# Altium project CATS-GS.PrjPcb
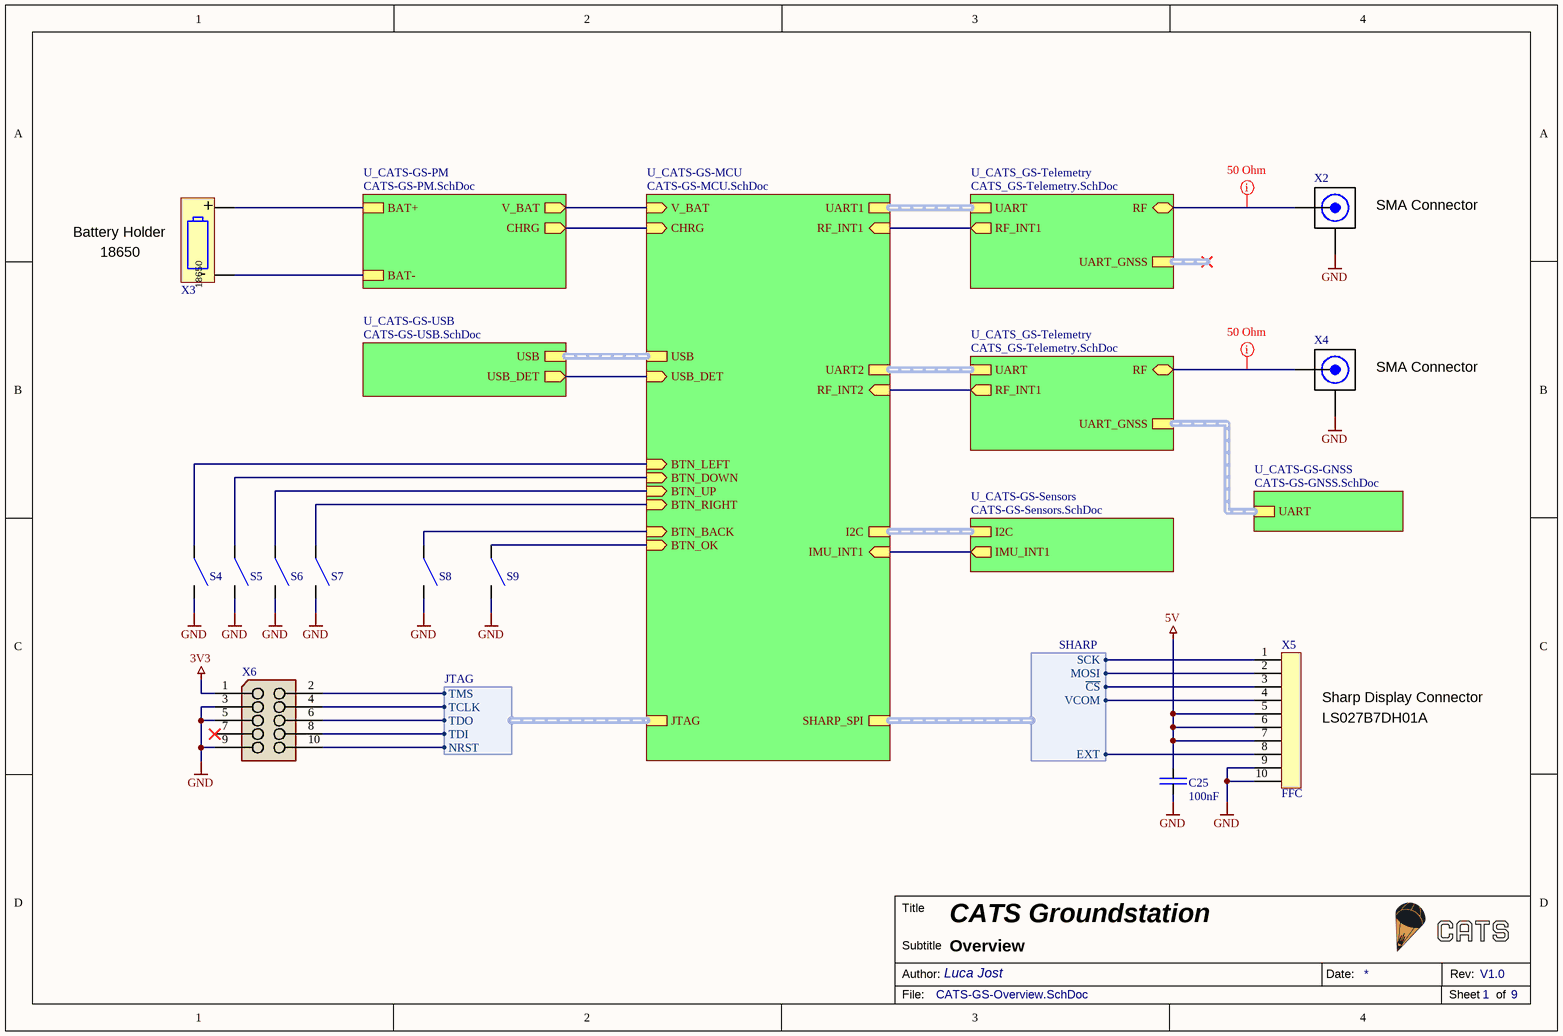
[diagram p0: CATS-GS-Overview.SchDoc]
9 sheets, 140 parts. Net scope: hierarchical (ports join the sheet entries above them; power ports are global).
Board file: CATS-GS.PcbDoc
Sheets:
  CATS-GS-Overview.SchDoc
    U_CATS-GS-Sensors = CATS-GS-Sensors.SchDoc
    U_CATS_GS-Telemetry = CATS_GS-Telemetry.SchDoc
      U_Reefing-Radio = CATS_GS-Radio.SchDoc
      U_Reefing-Radio_MCU = CATS_GS-Radio_MCU.SchDoc
    U_CATS_GS-Telemetry = CATS_GS-Telemetry.SchDoc
      U_Reefing-Radio = CATS_GS-Radio.SchDoc
      U_Reefing-Radio_MCU = CATS_GS-Radio_MCU.SchDoc
    U_CATS-GS-GNSS = CATS-GS-GNSS.SchDoc
    U_CATS-GS-PM = CATS-GS-PM.SchDoc
    U_CATS-GS-USB = CATS-GS-USB.SchDoc
    U_CATS-GS-MCU = CATS-GS-MCU.SchDoc

## Sheet CATS-GS-Overview.SchDoc: CATS Groundstation
size A4; DocumentNumber: Overview; Revision: V1.0; SheetNumber: 1; SheetTotal: 9; Author: Luca Jost; Subtitle: Overview

### Parts
C25  100nF  [SMD Keramikkondensator 0402]
S4  SMD-Button  [SMD Button 4.2x3.2]  (value not drawn)
S5  SMD-Button  [SMD Button 4.2x3.2]  (value not drawn)
S6  SMD-Button  [SMD Button 4.2x3.2]  (value not drawn)
S7  SMD-Button  [SMD Button 4.2x3.2]  (value not drawn)
S8  SMD-Button  [SMD Button 4.2x3.2]  (value not drawn)
S9  SMD-Button  [SMD Button 4.2x3.2]  (value not drawn)
X2  SMA Connector  [SMD Connector SMA]  (value not drawn)
X3  18650  [SMD 18650 Batttery Holder]  (value not drawn)
X4  SMA Connector  [SMD Connector SMA]  (value not drawn)
X5  FFC  [SMD Connector FFC/FPC 10Pin / 0.5mm Pitch]
X6  JTAG-Header (ARM-Cortex)  [SMD Connector 1.27mm (2x5)]  (value not drawn)

### Sub-sheets
U_CATS-GS-GNSS = CATS-GS-GNSS.SchDoc: UART (harness UART)
U_CATS-GS-MCU = CATS-GS-MCU.SchDoc: SHARP_SPI (harness SHARP), USB (harness USB), JTAG (harness JTAG), UART2 (harness UART), UART1 (harness UART), RF_INT1 (in), RF_INT2 (in), I2C, IMU_INT1 (in), USB_DET (in), CHRG (in), V_BAT (in), BTN_OK (in), BTN_BACK (in), BTN_RIGHT (in), BTN_UP (in), BTN_DOWN (in), BTN_LEFT (in)
U_CATS-GS-PM = CATS-GS-PM.SchDoc: BAT+, BAT-, V_BAT (out), CHRG (out)
U_CATS-GS-Sensors = CATS-GS-Sensors.SchDoc: I2C (harness I2C), IMU_INT1 (out)
U_CATS-GS-USB = CATS-GS-USB.SchDoc: USB (harness USB), USB_DET (out)
U_CATS_GS-Telemetry = CATS_GS-Telemetry.SchDoc: UART, RF_INT1 (out), UART_GNSS, RF (bidir)
U_CATS_GS-Telemetry = CATS_GS-Telemetry.SchDoc: UART, RF_INT1 (out), UART_GNSS, RF (bidir)

### Harnesses
JTAG: TMS, TDI, TDO, TCLK, NRST
SHARP: MOSI, ~{CS}, SCK, VCOM, EXT

### Nets
3V3: X6.1
5V: C25.2 X5.5 X5.6 X5.7
BGND: X3.2(-) ; sheet U_CATS-GS-PM/BAT-
GND: C25.1 S4.2 S5.2 S6.2 S7.2 S8.2 S9.2 X2.2(RF) X4.2(RF) X5.9 X5.10 X6.3 X6.5 X6.9
VBAT: X3.1(+) ; sheet U_CATS-GS-PM/BAT+
~{CS}: X5.3 ; sheet U_CATS-GS-MCU/SHARP_SPI.~{CS}
DIS_EXT: X5.8 ; sheet U_CATS-GS-MCU/SHARP_SPI.EXT
DIS_VCOM: X5.4 ; sheet U_CATS-GS-MCU/SHARP_SPI.VCOM
JTAG_NRST: X6.10 ; sheet U_CATS-GS-MCU/JTAG.NRST
JTAG_TCLK: X6.4 ; sheet U_CATS-GS-MCU/JTAG.TCLK
JTAG_TDI: X6.8 ; sheet U_CATS-GS-MCU/JTAG.TDI
JTAG_TDO: X6.6 ; sheet U_CATS-GS-MCU/JTAG.TDO
JTAG_TMS: X6.2 ; sheet U_CATS-GS-MCU/JTAG.TMS
MOSI: X5.2 ; sheet U_CATS-GS-MCU/SHARP_SPI.MOSI
RF_INT1: sheet U_CATS_GS-Telemetry/RF_INT1, sheet U_CATS-GS-MCU/RF_INT1
RF_INT1: sheet U_CATS_GS-Telemetry/RF_INT1, sheet U_CATS-GS-MCU/RF_INT2  [a separate net that carries the same name]
SCK: X5.1 ; sheet U_CATS-GS-MCU/SHARP_SPI.SCK
NetC5_2: sheet U_CATS-GS-PM/V_BAT, sheet U_CATS-GS-MCU/V_BAT
NetFL1_U_CATS_GS-Telemetry_U_Reefing-Radio#1_3: X2.1(RF) ; sheet U_CATS_GS-Telemetry/RF
NetFL1_U_CATS_GS-Telemetry_U_Reefing-Radio#2_3: X4.1(RF) ; sheet U_CATS_GS-Telemetry/RF
NetP1_K: sheet U_CATS-GS-PM/CHRG, sheet U_CATS-GS-MCU/CHRG
NetR1_2: sheet U_CATS-GS-USB/USB_DET, sheet U_CATS-GS-MCU/USB_DET
NetS4_1: S4.1 ; sheet U_CATS-GS-MCU/BTN_LEFT
NetS5_1: S5.1 ; sheet U_CATS-GS-MCU/BTN_DOWN
NetS6_1: S6.1 ; sheet U_CATS-GS-MCU/BTN_UP
NetS7_1: S7.1 ; sheet U_CATS-GS-MCU/BTN_RIGHT
NetS8_1: S8.1 ; sheet U_CATS-GS-MCU/BTN_BACK
NetS9_1: S9.1 ; sheet U_CATS-GS-MCU/BTN_OK
NetTP17_1: sheet U_CATS-GS-Sensors/IMU_INT1, sheet U_CATS-GS-MCU/IMU_INT1

Not connected (* = marked no-connect by the designer): X6 7*

### Buses and harness runs
harness sheet U_CATS-GS-GNSS/UART = sheet U_CATS_GS-Telemetry/UART_GNSS
harness sheet U_CATS-GS-MCU/I2C = sheet U_CATS-GS-Sensors/I2C
harness sheet U_CATS-GS-MCU/UART1 = sheet U_CATS_GS-Telemetry/UART
harness sheet U_CATS-GS-MCU/UART2 = sheet U_CATS_GS-Telemetry/UART
harness sheet U_CATS-GS-MCU/USB = sheet U_CATS-GS-USB/USB

### Layout directives
rule Impedance Constraint [Min = 50.00    Max = 50.00    ]; net class RF-Line 50: NetFL1_U_CATS_GS-Telemetry_U_Reefing-Radio#1_3, NetFL1_U_CATS_GS-Telemetry_U_Reefing-Radio#2_3

### Notes on the sheet
- (near X3) Battery Holder
- (near X2) SMA Connector
- 18650
- (near X4) SMA Connector
- (near X5) Sharp Display Connector
- (near X5) LS027B7DH01A
- Title
- Author:
- Subtitle
- Date:
- Rev:
- File:
- Sheet
- of

### Library data of the parts
C25 = E6 - 100nF: SMD Ceramic Capacitor E6; Unit Price: 0.01; JLC: C307331
S4-S9 = Button 4.2mmx3.2mm: Button SPST; LCSC: C139797
X2 X4 = SMA Connector: Female SMA Connector THT; JLC: C496550
X3 = 18650 Battery Holder: Single 18650 Battery Holder; JLC: C2988620; ComponentLink1Description: Datasheet; ComponentLink1URL: https://datasheet.lcsc.com/lcsc/2204021730_MYOUNG-BH-18650-B1BA002_C2988620.pdf
X5 = FPC/FFC 10 Pin / P 0.5: 10 Pin FPC/FFC Connector 0.5mm Pitch, Bottom Contact; JLC: C481219; ComponentLink1Description: Datasheet; ComponentLink1URL: https://datasheet.lcsc.com/lcsc/2001071405_XFCN-F0502-B-10-20T-R_C481219.pdf
X6 = X-JTAG-Header (ARM-Cortex): Component Value: SHF-105-01-L-D-SM (2x5); Digikey: SAM10710-ND; Farnell: 1885915; Mouser: 200-SHF10501LDSM; Unit Price: 2.89; ComponentLink1Description: Datasheet; ComponentLink1URL: https://datasheet.lcsc.com/lcsc/1810170717_UNI-ROYAL-Uniroyal-Elec-4D03WGJ0331T5E_C12018.pdf; Component Description: JTAG-Header (ARM-Cortex)

## Sheet CATS-GS-Sensors.SchDoc: CATS Groundstation
size A4; DocumentNumber: Overview; Revision: V1.0; SheetNumber: 4; SheetTotal: 9; Author: Luca Jost; Subtitle: Sensors
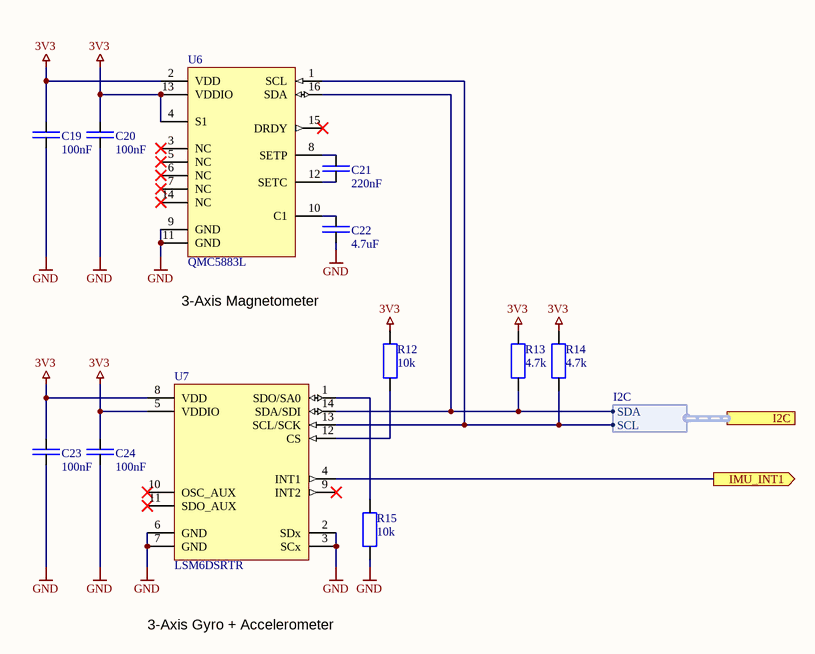
[diagram p1: CATS-GS-Sensors.SchDoc]

### Parts
C19  100nF  [SMD Keramikkondensator 0402]
C20  100nF  [SMD Keramikkondensator 0402]
C21  220nF  [SMD Keramikkondensator 0402]
C22  4.7uF  [SMD Keramikkondensator 0402]
C23  100nF  [SMD Keramikkondensator 0402]
C24  100nF  [SMD Keramikkondensator 0402]
R12  10k  [SMD Widerstand 0402]
R13  4.7k  [SMD Widerstand 0402]
R14  4.7k  [SMD Widerstand 0402]
R15  10k  [SMD Widerstand 0402]
U6  QMC5883L  [SMD IC LGA-16 4/4]
U7  LSM6DSRTR  [SMD IC LGA-14]

### Ports
I2C (harness I2C), IMU_INT1 (out)

### Harnesses
I2C: SCL, SDA

### Nets
3V3: C19.2 C20.2 C23.2 C24.2 R12.2 R13.2 R14.2 U6.2(VDD) U6.4(S1) U6.13(VDDIO) U7.5(VDDIO) U7.8(VDD)
GND: C19.1 C20.1 C22.1 C23.1 C24.1 R15.1 U6.9(GND) U6.11(GND) U7.2(SDx) U7.3(SCx) U7.6(GND) U7.7(GND)
SCL: R14.1 U6.1(SCL) U7.13(SCL/SCK) ; port I2C.SCL
SDA: R13.1 U6.16(SDA) U7.14(SDA/SDI) ; port I2C.SDA
NetC21_1: C21.1 U6.12(SETC)
NetC21_2: C21.2 U6.8(SETP)
NetC22_2: C22.2 U6.10(C1)
NetR12_1: R12.1 U7.12(CS)
NetR15_2: R15.2 U7.1(SDO/SA0)
NetTP17_1: U7.4(INT1) ; port IMU_INT1

Not connected (* = marked no-connect by the designer): U6 3(NC)* 5(NC)* 6(NC)* 7(NC)* 14(NC)* 15(DRDY)*; U7 9(INT2)* 10(OSC_AUX)* 11(SDO_AUX)*

### Notes on the sheet
- 3-Axis Magnetometer
- 3-Axis Gyro + Accelerometer
- Title
- Author:
- Subtitle
- Date:
- Rev:
- File:
- Sheet
- of

### Library data of the parts
C19 C20 C23 C24 = E6 - 100nF: SMD Ceramic Capacitor E6; Unit Price: 0.01; JLC: C307331
C21 = E6 - 220nF: SMD Ceramic Capacitor E6; Unit Price: 0.01; Number: -; Supplier: -; JLC: C16772
C22 = E6 - 4.7uF: SMD Ceramic Capacitor E6; Unit Price: 0.01; JLC: C23733
R12 R15 = E24 - 10k: SMD Chip Resistor E24; Unit Price: 0.01; Number: -; Supplier: -; JLC: C25744
R13 R14 = E24 - 4.7k: SMD Chip Resistor E24; Unit Price: 0.01; Number: -; Supplier: -; JLC: C25900
U6 = QMC5883L: 3-Axis Magnetic Sensor; JLC: C976032; ComponentLink1Description: Datasheet; ComponentLink1URL: https://datasheet.lcsc.com/lcsc/2012221837_QST-QMC5883L_C976032.pdf
U7 = LSM6DSRTR: Accelerometer, Gyroscope, Temperature, 6 Axis Sensor I²C, SPI Output; ComponentLink1Description: Datasheet; ComponentLink1URL: https://datasheet.lcsc.com/lcsc/2201131130_STMicroelectronics-LSM6DSRTR_C784817.pdf; JLC: C784817; Unit Price: 4.88

## Sheet CATS_GS-Telemetry.SchDoc: CATS Groundstation
size A4; DocumentNumber: Subtitle; Revision: V1.0; SheetNumber: 6; SheetTotal: 9; Author: Luca Jost; Subtitle: Telemetry
Used 2 times, as channels U_CATS_GS-Telemetry, U_CATS_GS-Telemetry. Parts and nets are listed once, with the designators drawn on the sheet.
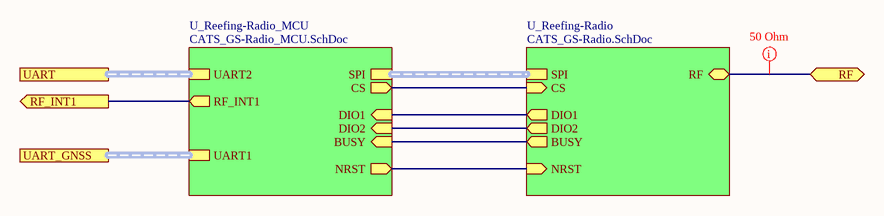
[diagram p2: CATS_GS-Telemetry.SchDoc]

### Sub-sheets
U_Reefing-Radio = CATS_GS-Radio.SchDoc: SPI (harness SPI), CS (in), BUSY (out), DIO1 (out), DIO2 (out), RF (bidir), NRST (in)
U_Reefing-Radio_MCU = CATS_GS-Radio_MCU.SchDoc: SPI (harness SPI), RF_INT1 (out), UART2 (harness UART), BUSY (in), DIO2 (in), DIO1 (in), CS (out), UART1 (harness UART), NRST (out)

### Ports
RF (bidir), RF_INT1 (out), UART, UART_GNSS

### Nets
RF: port RF, sheet U_Reefing-Radio/RF
RF_INT1: port RF_INT1, sheet U_Reefing-Radio_MCU/RF_INT1
(unnamed): sheet U_Reefing-Radio/CS, sheet U_Reefing-Radio_MCU/CS
(unnamed): sheet U_Reefing-Radio/BUSY, sheet U_Reefing-Radio_MCU/BUSY
(unnamed): sheet U_Reefing-Radio/DIO1, sheet U_Reefing-Radio_MCU/DIO1
(unnamed): sheet U_Reefing-Radio/DIO2, sheet U_Reefing-Radio_MCU/DIO2
(unnamed): sheet U_Reefing-Radio/NRST, sheet U_Reefing-Radio_MCU/NRST

### Channels
U_CATS_GS-Telemetry: ports RF=NetFL1_U_CATS_GS-Telemetry_U_Reefing-Radio#1_3 RF_INT1=RF_INT1
U_CATS_GS-Telemetry: ports RF=NetFL1_U_CATS_GS-Telemetry_U_Reefing-Radio#2_3 RF_INT1=RF_INT1

### Buses and harness runs
harness port UART = sheet U_Reefing-Radio_MCU/UART2
harness port UART_GNSS = sheet U_Reefing-Radio_MCU/UART1
harness sheet U_Reefing-Radio/SPI = sheet U_Reefing-Radio_MCU/SPI

### Layout directives
rule Impedance Constraint [Min = 50.00    Max = 50.00    ]; net class RF-Line 50: NetFL1_U_CATS_GS-Telemetry_U_Reefing-Radio#1_3

### Notes on the sheet
- Title
- Author:
- Subtitle
- Date:
- Rev:
- File:
- Sheet
- of

## Sheet CATS_GS-Radio.SchDoc: CATS Groundstation
size A4; DocumentNumber: Subtitle; Revision: V1.0; SheetNumber: 8; SheetTotal: 9; Author: Luca Jost; Subtitle: Radio
Used 2 times, as channels U_CATS_GS-Telemetry/U_Reefing-Radio, U_CATS_GS-Telemetry/U_Reefing-Radio. Parts and nets are listed once, with the designators drawn on the sheet.
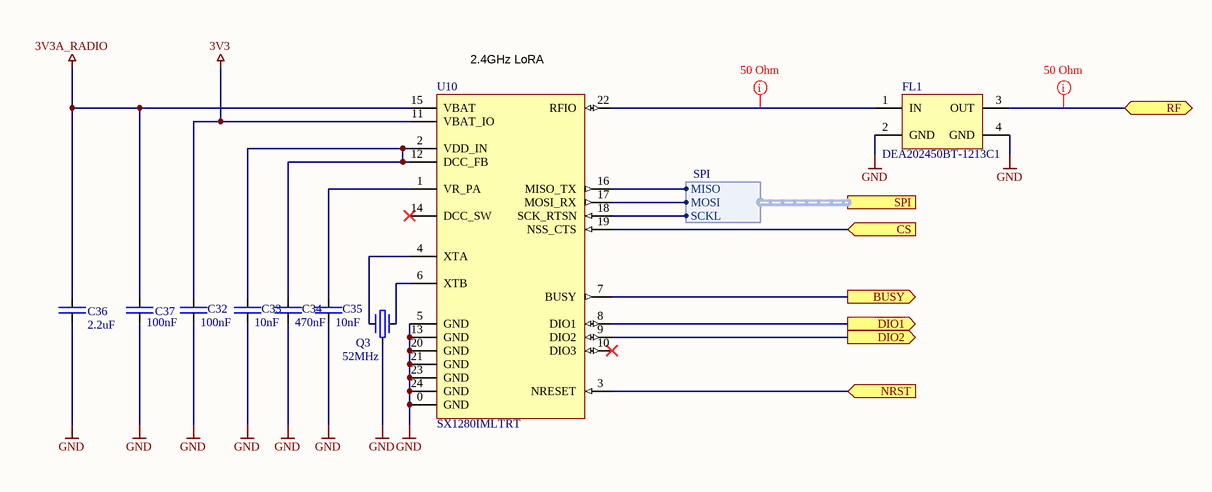
[diagram p3: CATS_GS-Radio.SchDoc]

### Parts
C32  100nF  [SMD Keramikkondensator 0402]
C33  10nF  [SMD Keramikkondensator 0402]
C34  470nF  [SMD Keramikkondensator 0402]
C35  10nF  [SMD Keramikkondensator 0402]
C36  2.2uF  [SMD Keramikkondensator 0402]
C37  100nF  [SMD Keramikkondensator 0402]
FL1  DEA202450BT-1213C1  [SMD Filter DEA202450BT]
Q3  52MHz  [SMD Crystal 2520]
U10  SX1280IMLTRT  [SMD IC QFN-24]

### Ports
BUSY (out), CS (in), DIO1 (out), DIO2 (out), NRST (in), RF (bidir), SPI (harness SPI)

### Harnesses
SPI: SCKL, MOSI, MISO

### Nets
3V3: C32.2 U10.11(VBAT_IO)
3V3A_RADIO: C36.2 C37.2 U10.15(VBAT)
GND: C32.1 C33.1 C34.1 C35.1 C36.1 C37.1 FL1.2(GND) FL1.4(GND) Q3.3 U10.0(GND) U10.5(GND) U10.13(GND) U10.20(GND) U10.21(GND) U10.23(GND) U10.24(GND)
BUSY: U10.7(BUSY) ; port BUSY
CS: U10.19(NSS_CTS) ; port CS
DIO1: U10.8(DIO1) ; port DIO1
DIO2: U10.9(DIO2) ; port DIO2
NRST: U10.3(NRESET) ; port NRST
RF: FL1.3(OUT) ; port RF
NetC33_2: C33.2 C34.2 U10.2(VDD_IN) U10.12(DCC_FB)
NetC35_2: C35.2 U10.1(VR_PA)
NetFL1_1: FL1.1(IN) U10.22(RFIO)
NetQ3_1: Q3.1 U10.4(XTA)
NetQ3_2: Q3.2 U10.6(XTB)
NetU10_16: U10.16(MISO_TX) ; port SPI.MISO
NetU10_17: U10.17(MOSI_RX) ; port SPI.MOSI
NetU10_18: U10.18(SCK_RTSN) ; port SPI.SCKL

Not connected (* = marked no-connect by the designer): U10 10(DIO3)* 14(DCC_SW)*

### Channels
U_CATS_GS-Telemetry/U_Reefing-Radio: designators end in _U_CATS_GS-Telemetry_U_Reefing-Radio#1; ports BUSY=BUSY CS=CS DIO1=DIO1 DIO2=DIO2 NRST=NetU9_U_CATS_GS-Telemetry_U_Reefing-Radio_MCU#1_19 RF=NetFL1_U_CATS_GS-Telemetry_U_Reefing-Radio#1_3
U_CATS_GS-Telemetry/U_Reefing-Radio: designators end in _U_CATS_GS-Telemetry_U_Reefing-Radio#2; ports BUSY=BUSY CS=CS DIO1=DIO1 DIO2=DIO2 NRST=NetU9_U_CATS_GS-Telemetry_U_Reefing-Radio_MCU#2_19 RF=NetFL1_U_CATS_GS-Telemetry_U_Reefing-Radio#2_3

### Layout directives
rule Impedance Constraint [Min = 50.00    Max = 50.00    ]; net class RF-Line 50: NetFL1_U_CATS_GS-Telemetry_U_Reefing-Radio#1_1, NetFL1_U_CATS_GS-Telemetry_U_Reefing-Radio#1_3

### Notes on the sheet
- (near U10) 2.4GHz LoRA
- Title
- Author:
- Subtitle
- Date:
- Rev:
- File:
- Sheet
- of

### Library data of the parts
C32 C37 = E6 - 100nF: SMD Ceramic Capacitor E6; Unit Price: 0.01; JLC: C307331
C33 C35 = E6 - 10nF: SMD Ceramic Capacitor E6; Unit Price: 0.01; JLC: C15195
C34 = E6 - 470nF: SMD Ceramic Capacitor E6; Unit Price: 0.01; JLC: C47339
C36 = E6 - 2.2uF: SMD Ceramic Capacitor E6; Unit Price: 0.01; JLC: C193620
FL1 = DEA202450BT-1213C1: Multilayer Band Pass Filter 2400-2500MHz; ComponentLink1Description: Datasheet; ComponentLink1URL: https://datasheet.lcsc.com/lcsc/1811021613_TDK-DEA202450BT-1213C1_C307898.pdf; JLC: C307898
Q3 = Crystal 52MHz - 2520: 52Mhz Ceramic 2.5 x 2.0mm SMD 10pF 60Ω ±10ppm; JLC: C963550; ComponentLink1Description: Datasheet; ComponentLink1URL: https://datasheet.lcsc.com/lcsc/2012211835_WTL-WTL2M75523TW_C963550.pdf; Unit Price: 0.39
U10 = SX1280IMLTRT: Long Range, Low Power, 2.4 GHz / Transceiver with Ranging Capability; ComponentLink1Description: Datasheet; ComponentLink1URL: https://media.digikey.com/pdf/Data%20Sheets/Semtech%20PDFs/SX1280-81_Rev3.2_Mar2020.pdf; Digikey: SX1280IMLTRTCT-ND; JLC: C125969; Unit Price: 3.20

## Sheet CATS_GS-Radio_MCU.SchDoc: CATS Groundstation
size A4; DocumentNumber: Subtitle; Revision: V1.0; SheetNumber: 7; SheetTotal: 9; Author: Luca Jost; Subtitle: Radio MCU
Used 2 times, as channels U_CATS_GS-Telemetry/U_Reefing-Radio_MCU, U_CATS_GS-Telemetry/U_Reefing-Radio_MCU. Parts and nets are listed once, with the designators drawn on the sheet.
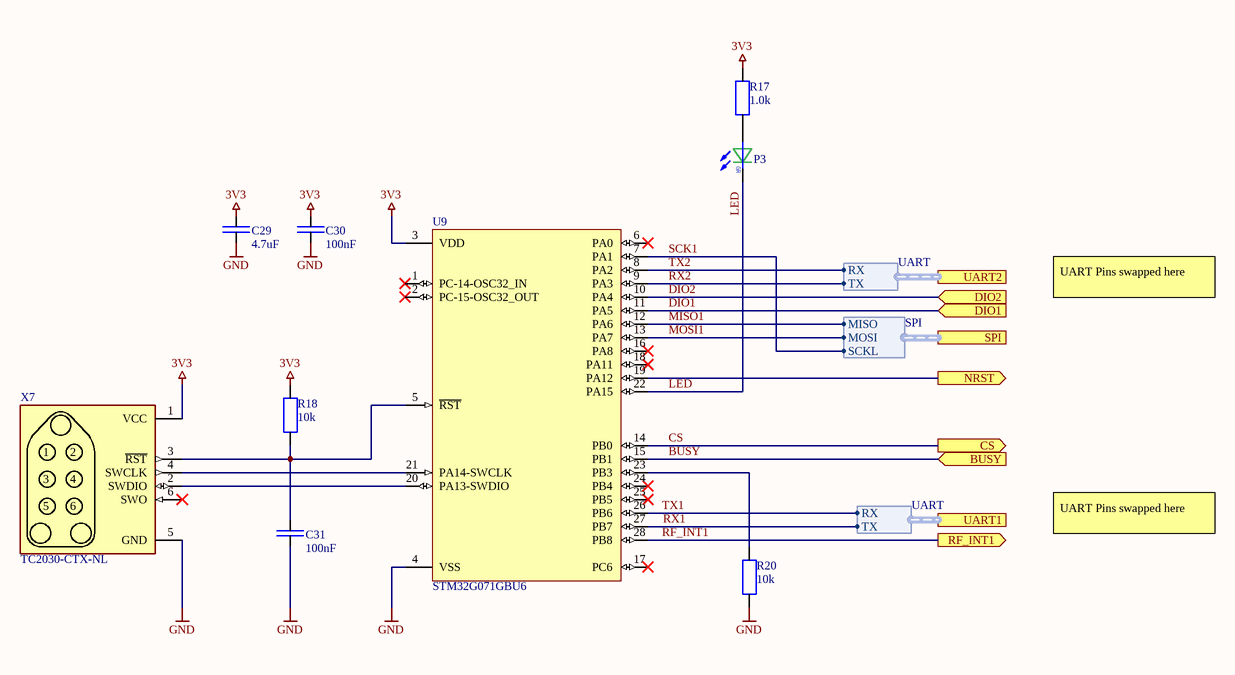
[diagram p4: CATS_GS-Radio_MCU.SchDoc]

### Parts
C29  4.7uF  [SMD Keramikkondensator 0402]
C30  100nF  [SMD Keramikkondensator 0402]
C31  100nF  [SMD Keramikkondensator 0402]
P3  LED  [SMD LED 0603]  (value not drawn)
R17  1.0k  [SMD Widerstand 0402]
R18  10k  [SMD Widerstand 0402]
R20  10k  [SMD Widerstand 0402]
U9  STM32G071GBU6  [SMD IC QFN-28 4x4 0.5 Pitch]
X7  TC2030-CTX-NL  [SMD Connector TC2030]  (no BOM)

### Ports
BUSY (in), CS (out), DIO1 (in), DIO2 (in), NRST (out), RF_INT1 (out), SPI (harness SPI), UART1 (harness UART), UART2 (harness UART)

### Harnesses
SPI: SCKL, MOSI, MISO
UART: RX, TX

### Nets
3V3: C29.2 C30.2 R17.2 R18.2 U9.3(VDD) X7.1(VCC)
GND: C29.1 C30.1 C31.1 R20.1 U9.4(VSS) X7.5(GND)
BUSY: U9.15(PB1) ; port BUSY
CS: U9.14(PB0) ; port CS
DIO1: U9.11(PA5) ; port DIO1
DIO2: U9.10(PA4) ; port DIO2
LED: P3.K U9.22(PA15)
MISO1: U9.12(PA6) ; port SPI.MISO
MOSI1: U9.13(PA7) ; port SPI.MOSI
NRST: U9.19(PA12) ; port NRST
RF_INT1: U9.28(PB8) ; port RF_INT1
RX1: U9.27(PB7) ; port UART1.TX
RX2: U9.9(PA3) ; port UART2.TX
SCK1: U9.7(PA1) ; port SPI.SCKL
TX1: U9.26(PB6) ; port UART1.RX
TX2: U9.8(PA2) ; port UART2.RX
NetC31_2: C31.2 R18.1 U9.5(~{RST}) X7.3(~{RST})
NetP3_A: P3.A R17.1
NetR20_2: R20.2 U9.23(PB3)
NetU9_20: U9.20(PA13-SWDIO) X7.2(SWDIO)
NetU9_21: U9.21(PA14-SWCLK) X7.4(SWCLK)

Not connected (* = marked no-connect by the designer): U9 1(PC-14-OSC32_IN)* 2(PC-15-OSC32_OUT)* 6(PA0)* 16(PA8)* 17(PC6)* 18(PA11)* 24(PB4)* 25(PB5)*; X7 6(SWO)*

### Channels
U_CATS_GS-Telemetry/U_Reefing-Radio_MCU: designators end in _U_CATS_GS-Telemetry_U_Reefing-Radio_MCU#1; ports BUSY=BUSY CS=CS DIO1=DIO1 DIO2=DIO2 NRST=NetU9_U_CATS_GS-Telemetry_U_Reefing-Radio_MCU#1_19 RF_INT1=RF_INT1
U_CATS_GS-Telemetry/U_Reefing-Radio_MCU: designators end in _U_CATS_GS-Telemetry_U_Reefing-Radio_MCU#2; ports BUSY=BUSY CS=CS DIO1=DIO1 DIO2=DIO2 NRST=NetU9_U_CATS_GS-Telemetry_U_Reefing-Radio_MCU#2_19 RF_INT1=RF_INT1

### Notes on the sheet
- UART Pins swapped here
- Title
- Author:
- Subtitle
- Date:
- Rev:
- File:
- Sheet
- of
- (in symbol LED) GR

### Library data of the parts
C29 = E6 - 4.7uF: SMD Ceramic Capacitor E6; Unit Price: 0.01; JLC: C23733
C30 C31 = E6 - 100nF: SMD Ceramic Capacitor E6; Unit Price: 0.01; JLC: C307331
P3 = LED: Color LED; JLC: C72043
R17 = E24 - 1.0k: SMD Chip Resistor E24; Unit Price: 0.01; JLC: C11702
R18 R20 = E24 - 10k: SMD Chip Resistor E24; Unit Price: 0.01; JLC: C25744
U9 = STM32G071GBU6: ARM® Cortex®-M0+ series Microcontroller IC 32-Bit 64MHz 128KB (128K x 8) FLASH 28-UFQFPN (4x4); Digikey: 497-18343-ND; JLC: C529347; ComponentLink1Description: Datasheet; ComponentLink1URL: https://media.digikey.com/pdf/Data%20Sheets/ST%20Microelectronics%20PDFS/STM32G071_Rev1_DS.pdf; Unit Price: 4.07
X7 = TC2030-CTX-NL: Tag-Connect for ARM-Cortex (6-Pin); Unit Price: 0.00

## Sheet CATS-GS-GNSS.SchDoc: CATS Groundstation
size A4; DocumentNumber: Overview; Revision: V1.0; SheetNumber: 9; SheetTotal: 9; Author: Luca Jost; Subtitle: GNSS
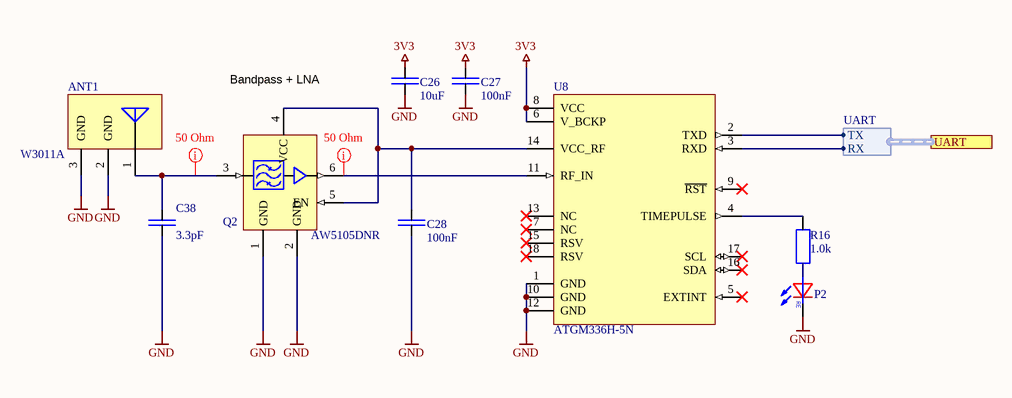
[diagram p5: CATS-GS-GNSS.SchDoc]

### Parts
ANT1  W3011A  [SMD Antenna W3011A]
C26  10uF  [SMD Keramikkondensator 0603]
C27  100nF  [SMD Keramikkondensator 0402]
C28  100nF  [SMD Keramikkondensator 0402]
C38  3.3pF  [SMD Keramikkondensator 0402]
P2  LED  [SMD LED 0603]  (value not drawn)
Q2  AW5105DNR  [SMD LNA AW5105DNR]
R16  1.0k  [SMD Widerstand 0402]
U8  ATGM336H-5N  [SMD MAX-8]

### Ports
UART (harness UART)

### Harnesses
UART: TX, RX

### Nets
3V3: C26.2 C27.2 U8.6(V_BCKP) U8.8(VCC)
GND: ANT1.2(GND) ANT1.3(GND) C26.1 C27.1 C28.1 C38.1 P2.K Q2.1(GND) Q2.2(GND) U8.1(GND) U8.10(GND) U8.12(GND)
RX1: U8.2(TXD) ; port UART.TX
TX1: U8.3(RXD) ; port UART.RX
NetANT1_1: ANT1.1 C38.2 Q2.3
NetC28_2: C28.2 Q2.4(VCC) Q2.5(EN) U8.14(VCC_RF)
NetP2_A: P2.A R16.1
NetQ2_6: Q2.6(EN) U8.11(RF_IN)
NetR16_2: R16.2 U8.4(TIMEPULSE)

Not connected (* = marked no-connect by the designer): U8 5(EXTINT)* 7(NC)* 9(~{RST})* 13(NC)* 15(RSV)* 16(SDA)* 17(SCL)* 18(RSV)*

### Layout directives
rule Impedance Constraint [Min = 50.00    Max = 50.00    ]; net class RF-Line 50: NetANT1_1, NetQ2_6

### Notes on the sheet
- (near Q2) Bandpass + LNA
- Title
- Author:
- Subtitle
- Date:
- Rev:
- File:
- Sheet
- of
- (in symbol LED) RE

### Library data of the parts
ANT1 = W3011A: RF ANT 1.575GHZ CHIP SOLDER SMD; ComponentLink1Description: Datasheet; ComponentLink1URL: https://media.digikey.com/pdf/Data%20Sheets/Pulse%20PDFs/W3011A_DS.pdf; Digikey: 553-1671-1-ND
C26 = E6 - 10uF: SMD Ceramic Capacitor E6; Unit Price: 0.01; JLC: C70225
C27 C28 = E6 - 100nF: SMD Ceramic Capacitor E6; Unit Price: 0.01; JLC: C307331
C38 = E6 - 3.3nF: SMD Ceramic Capacitor E6; Unit Price: 0.01; Number: -; JLC: C1565
P2 = LED: Color LED; JLC: C2286
Q2 = AW5105DNR: BDS/GPS/GNSS INTEGRATED FRONT-END MODULE WITH / LOW NOISE AMPLIFIER AND FILTER; ComponentLink1Description: Datasheet; ComponentLink1URL: https://datasheet.lcsc.com/lcsc/2008041805_AWINIC-Shanghai-Awinic-Tech-AW5105DNR_C506193.pdf; JLC: C506193
R16 = E24 - 1.0k: SMD Chip Resistor E24; Unit Price: 0.01; Number: -; Supplier: -; JLC: C11702
U8 = ATGM336H-5N: Chinese Crap GNSS Module; ComponentLink1Description: Datasheet; ComponentLink1URL: https://datasheet.lcsc.com/lcsc/1810261521_ZHONGKEWEI-ATGM336H-5N31_C90770.pdf; JLC: C90770

## Sheet CATS-GS-PM.SchDoc: CATS Groundstation
size A4; DocumentNumber: Overview; Revision: V1.0; SheetNumber: 2; SheetTotal: 9; Author: Luca Jost; Subtitle: Power Management
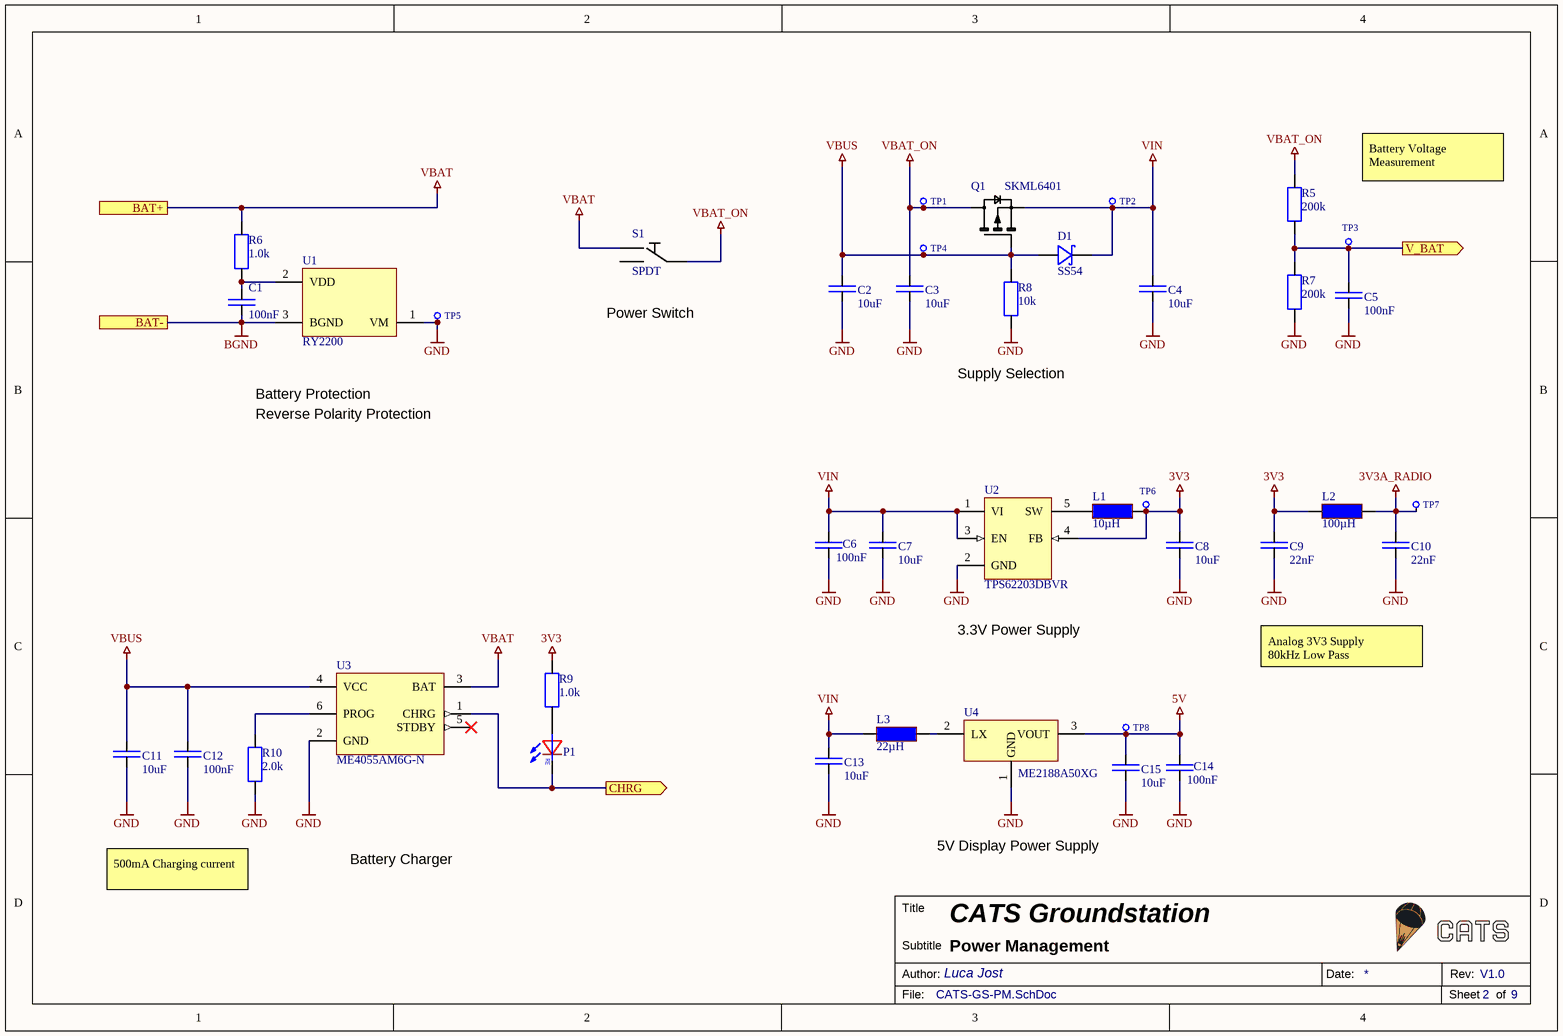
[diagram p6: CATS-GS-PM.SchDoc]

### Parts
C1  100nF  [SMD Keramikkondensator 0402]
C2  10uF  [SMD Keramikkondensator 0603]
C3  10uF  [SMD Keramikkondensator 0603]
C4  10uF  [SMD Keramikkondensator 0603]
C5  100nF  [SMD Keramikkondensator 0402]
C6  100nF  [SMD Keramikkondensator 0402]
C7  10uF  [SMD Keramikkondensator 0603]
C8  10uF  [SMD Keramikkondensator 0603]
C9  22nF  [SMD Keramikkondensator 0603]
C10  22nF  [SMD Keramikkondensator 0603]
C11  10uF  [SMD Keramikkondensator 0603]
C12  100nF  [SMD Keramikkondensator 0402]
C13  10uF  [SMD Keramikkondensator 0603]
C14  100nF  [SMD Keramikkondensator 0402]
C15  10uF  [SMD Keramikkondensator 0603]
D1  SS54  [SMD Diode DO-214-AC]
L1  10µH  [SMD Inductor 4x4x1.8]
L2  100µH  [SMD Inductor 1812]
L3  22µH  [SMD Inductor 4x4x1.8]
P1  LED  [SMD LED 0603]  (value not drawn)
Q1  SKML6401  [SMD MOSFET SOT-23]
R5  200k  [SMD Widerstand 0402]
R6  1.0k  [SMD Widerstand 0402]
R7  200k  [SMD Widerstand 0402]
R8  10k  [SMD Widerstand 0402]
R9  1.0k  [SMD Widerstand 0402]
R10  2.0k  [SMD Widerstand 0402]
S1  SPDT  [SMD Switch SPDT 90° G-Switch]
TP1  X-TP  [SMD Testpoint 1mm]  (value not drawn)  (no BOM)
TP2  X-TP  [SMD Testpoint 1mm]  (value not drawn)  (no BOM)
TP3  X-TP  [SMD Testpoint 1mm]  (value not drawn)  (no BOM)
TP4  X-TP  [SMD Testpoint 1mm]  (value not drawn)  (no BOM)
TP5  X-TP  [SMD Testpoint 1mm]  (value not drawn)  (no BOM)
TP6  X-TP  [SMD Testpoint 1mm]  (value not drawn)  (no BOM)
TP7  X-TP  [SMD Testpoint 1mm]  (value not drawn)  (no BOM)
TP8  X-TP  [SMD Testpoint 1mm]  (value not drawn)  (no BOM)
U1  RY2200  [SMD IC SOT-23]
U2  TPS62203DBVR  [SMD IC SOT-23-5]
U3  ME4055AM6G-N  [SMD IC SOT-23-6]
U4  ME2188A50XG  [SMD IC SOT-23]

### Ports
BAT+, BAT-, CHRG (out), V_BAT (out)

### Nets
3V3: C8.2 C9.2 L1.2 L2.1 R9.2 TP6.1 U2.4(FB)
3V3A_RADIO: C10.2 L2.2 TP7.1
5V: C14.2 C15.2 TP8.1 U4.3(VOUT)
BGND: C1.1 U1.3(BGND) ; port BAT-
GND: C2.1 C3.1 C4.1 C5.1 C6.1 C7.1 C8.1 C9.1 C10.1 C11.1 C12.1 C13.1 C14.1 C15.1 R7.1 R8.1 R10.1 TP5.1 U1.1(VM) U2.2(GND) U3.2(GND) U4.1(GND)
VBAT: R6.2 S1.3 U3.3(BAT) ; port BAT+
VBAT_ON: C3.2 Q1.D R5.2 S1.2 TP1.1
VBUS: C2.2 C11.2 C12.2 D1.A Q1.G R8.2 TP4.1 U3.4(VCC)
VIN: C4.2 C6.2 C7.2 C13.2 D1.K L3.1 Q1.S TP2.1 U2.1(VI) U2.3(EN)
NetC1_2: C1.2 R6.1 U1.2(VDD)
NetC5_2: C5.2 R5.1 R7.2 TP3.1 ; port V_BAT
NetL1_1: L1.1 U2.5(SW)
NetL3_2: L3.2 U4.2(LX)
NetP1_A: P1.A R9.1
NetP1_K: P1.K U3.1(CHRG) ; port CHRG
NetR10_2: R10.2 U3.6(PROG)

Not connected (* = marked no-connect by the designer): S1 1; U3 5(STDBY)*

### Notes on the sheet
- Battery Voltage Measurement
- (near S1) Power Switch
- (near R8) Supply Selection
- Reverse Polarity Protection
- Battery Protection
- 3.3V Power Supply
- Analog 3V3 Supply
  80kHz Low Pass
- 5V Display Power Supply
- 500mA Charging current
- Battery Charger
- Title
- Author:
- Subtitle
- Date:
- Rev:
- File:
- Sheet
- of
- (in symbol LED) RE

### Library data of the parts
C1 C5 C6 C12 C14 = E6 - 100nF: SMD Ceramic Capacitor E6; Unit Price: 0.01; JLC: C307331
C2-C4 C7 C8 C11 C13 C15 = E6 - 10uF: SMD Ceramic Capacitor E6; Unit Price: 0.01; JLC: C70225
C9 C10 = E6 - 22nF: SMD Ceramic Capacitor E6; Unit Price: 0.01; JLC: C1729
D1 = SS54: 40V 5A 550mV @ 5A SMA(DO-214AC) Schottky Barrier Diodes (SBD) ROHS; ComponentLink1Description: Datasheet; ComponentLink1URL: https://datasheet.lcsc.com/lcsc/1810192041_MDD%EF%BC%88Microdiode-Electronics%EF%BC%89-SS54_C22452.pdf; JLC: C22452; Unit Price: 0.07
L1 = Inductor 10µH / 1.6A: 165mOhm SMD, 1.6A; ComponentLink1Description: Datasheet; ComponentLink1URL: https://datasheet.lcsc.com/lcsc/2108131530_SXN-Shun-Xiang-Nuo-Elec-SMNR4020-10UH_C135263.pdf; JLC: C135263; Unit Price: 0.07
L2 = Inductor 100µH / 0.25A: 0.25A 100µH ±20% 144mΩ SMD Power Inductors; ComponentLink1Description: Datasheet; ComponentLink1URL: https://datasheet.lcsc.com/lcsc/2110081330_Sunlord-SPH252012H3R3MT_C98379.pdf; JLC: C76822; Unit Price: 0.19
L3 = Inductor 22µH / 1A: 350mOhm SMD, 1A; ComponentLink1Description: Datasheet; ComponentLink1URL: https://datasheet.lcsc.com/lcsc/2108131530_SXN-Shun-Xiang-Nuo-Elec-SMNR4020-22UH_C135264.pdf; JLC: C135264
P1 = LED: Color LED; JLC: C2286
Q1 = SKML6401: P Channel MOSFET, 16V 3A, SOT-23; JLC: C475708; ComponentLink1Description: Datasheet; ComponentLink1URL: https://datasheet.lcsc.com/lcsc/2001131004_Shikues-SKML6401_C475708.pdf
R5 R7 = E24 - 200k: SMD Chip Resistor E24; Unit Price: 0.01; JLC: C25764
R6 R9 = E24 - 1.0k: SMD Chip Resistor E24; Unit Price: 0.01; JLC: C11702
R8 = E24 - 10k: SMD Chip Resistor E24; Unit Price: 0.01; Number: -; Supplier: -; JLC: C25744
R10 = E24 - 2.0k: SMD Chip Resistor E24; Unit Price: 0.01; Number: -; Supplier: -; JLC: C25879
S1 = Switch SPDT G-Switch: Slide Switch SPDT SMD; ComponentLink1Description: Datasheet; ComponentLink1URL: https://datasheet.lcsc.com/lcsc/2009021103_G-Switch-MK-12C02-G025_C778186.pdf; JLC: C778186
TP1 TP2 TP4 TP5 TP7 TP8 = X-TP: Testpunkt; Component Value: Ø 0.8mm; Component Description: Testpoint; Unit Price: 0.00
TP3 TP6 = X-TP: Testpunkt; Unit Price: 0.00
U1 = RY2200: One Cell Li-ion and Li-poly Battery Protection IC; JLC: C2888102; ComponentLink1Description: Datasheet; ComponentLink1URL: https://datasheet.lcsc.com/lcsc/2108251630_RYCHIP-Semiconductor-Inc--RY2200_C2888102.pdf
U2 = TPS62203DBVR: High-Efficiency Synchronous Step-Down / synchronous step-down converters ideally suited for Converter 3.3V; ComponentLink1Description: Datasheet; ComponentLink1URL: https://www.ti.com/lit/ds/symlink/tps62203.pdf?HQS=dis-mous-null-mousermode-dsf-pf-null-wwe&ts=1645451444570&ref_url=https%253A%252F%252Fwww.mouser.ch%252F; JLC: C9051; Unit Price: 1.03
U3 = ME4055AM6G-N: 800mA Lithium Ion Battery Linear Charger; ComponentLink1Description: Datasheet; ComponentLink1URL: https://datasheet.lcsc.com/lcsc/1809291612_MICRONE-Nanjing-Micro-One-Elec-ME4055AM6G-N_C82121.pdf; JLC: C82121; Unit Price: 0.10
U4 = ME2188A50XG: Fixed 5V Boost Converter; ComponentLink1Description: Datasheet; ComponentLink1URL: https://datasheet.lcsc.com/lcsc/1809041040_MICRONE-Nanjing-Micro-One-Elec-ME2188A50XG_C236769.pdf; JLC: C236769

## Sheet CATS-GS-USB.SchDoc: CATS Groundstation
size A4; DocumentNumber: Overview; Revision: V1.0; SheetNumber: 5; SheetTotal: 9; Author: Luca Jost; Subtitle: USB Connector
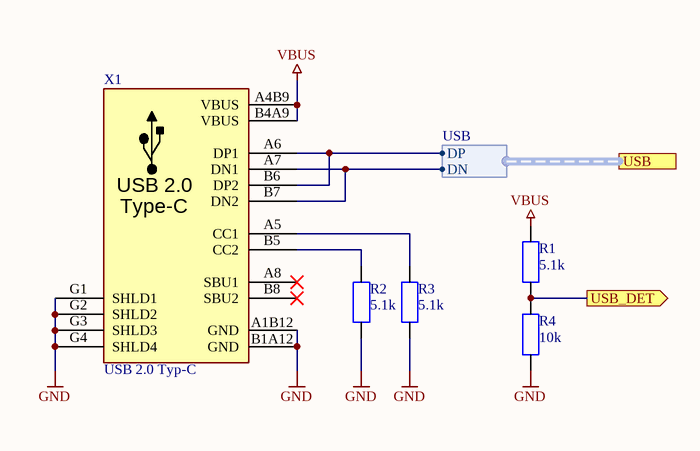
[diagram p7: CATS-GS-USB.SchDoc]

### Parts
R1  5.1k  [SMD Widerstand 0402]
R2  5.1k  [SMD Widerstand 0402]
R3  5.1k  [SMD Widerstand 0402]
R4  10k  [SMD Widerstand 0402]
X1  USB 2.0 Typ-C  [THT USB-C Socket (A40-00119)]

### Ports
USB (harness USB), USB_DET (out)

### Harnesses
USB: DP, DN

### Nets
GND: R2.1 R3.1 R4.2 X1.A1B12(GND) X1.B1A12(GND) X1.G1(SHLD1) X1.G2(SHLD2) X1.G3(SHLD3) X1.G4(SHLD4)
VBUS: R1.1 X1.A4B9(VBUS) X1.B4A9(VBUS)
USB_D_N: X1.A7(DN1) X1.B7(DN2) ; port USB.DN
USB_D_P: X1.A6(DP1) X1.B6(DP2) ; port USB.DP
NetR1_2: R1.2 R4.1 ; port USB_DET
NetR2_2: R2.2 X1.B5(CC2)
NetR3_2: R3.2 X1.A5(CC1)

Not connected (* = marked no-connect by the designer): X1 A8(SBU1)* B8(SBU2)*

### Notes on the sheet
- Title
- Author:
- Subtitle
- Date:
- Rev:
- File:
- Sheet
- of
- (in symbol USB Type-C USB 2.0) USB 2.0; Type-C

### Library data of the parts
R1-R3 = E24 - 5.1k: SMD Chip Resistor E24; Unit Price: 0.01; Number: -; Supplier: -; JLC: C25905
R4 = E24 - 10k: SMD Chip Resistor E24; Unit Price: 0.01; Number: -; Supplier: -; JLC: C25744
X1 = USB Type-C USB 2.0: Typ-C; aliExpress: 33045191307; Digikey: 2073-USB4105-GF-ACT-ND; Farnell: 3583366; JLC: C167321

## Sheet CATS-GS-MCU.SchDoc: CATS Groundstation
size A4; DocumentNumber: Overview; Revision: V1.0; SheetNumber: 3; SheetTotal: 9; Author: Luca Jost; Subtitle: Microcontroller
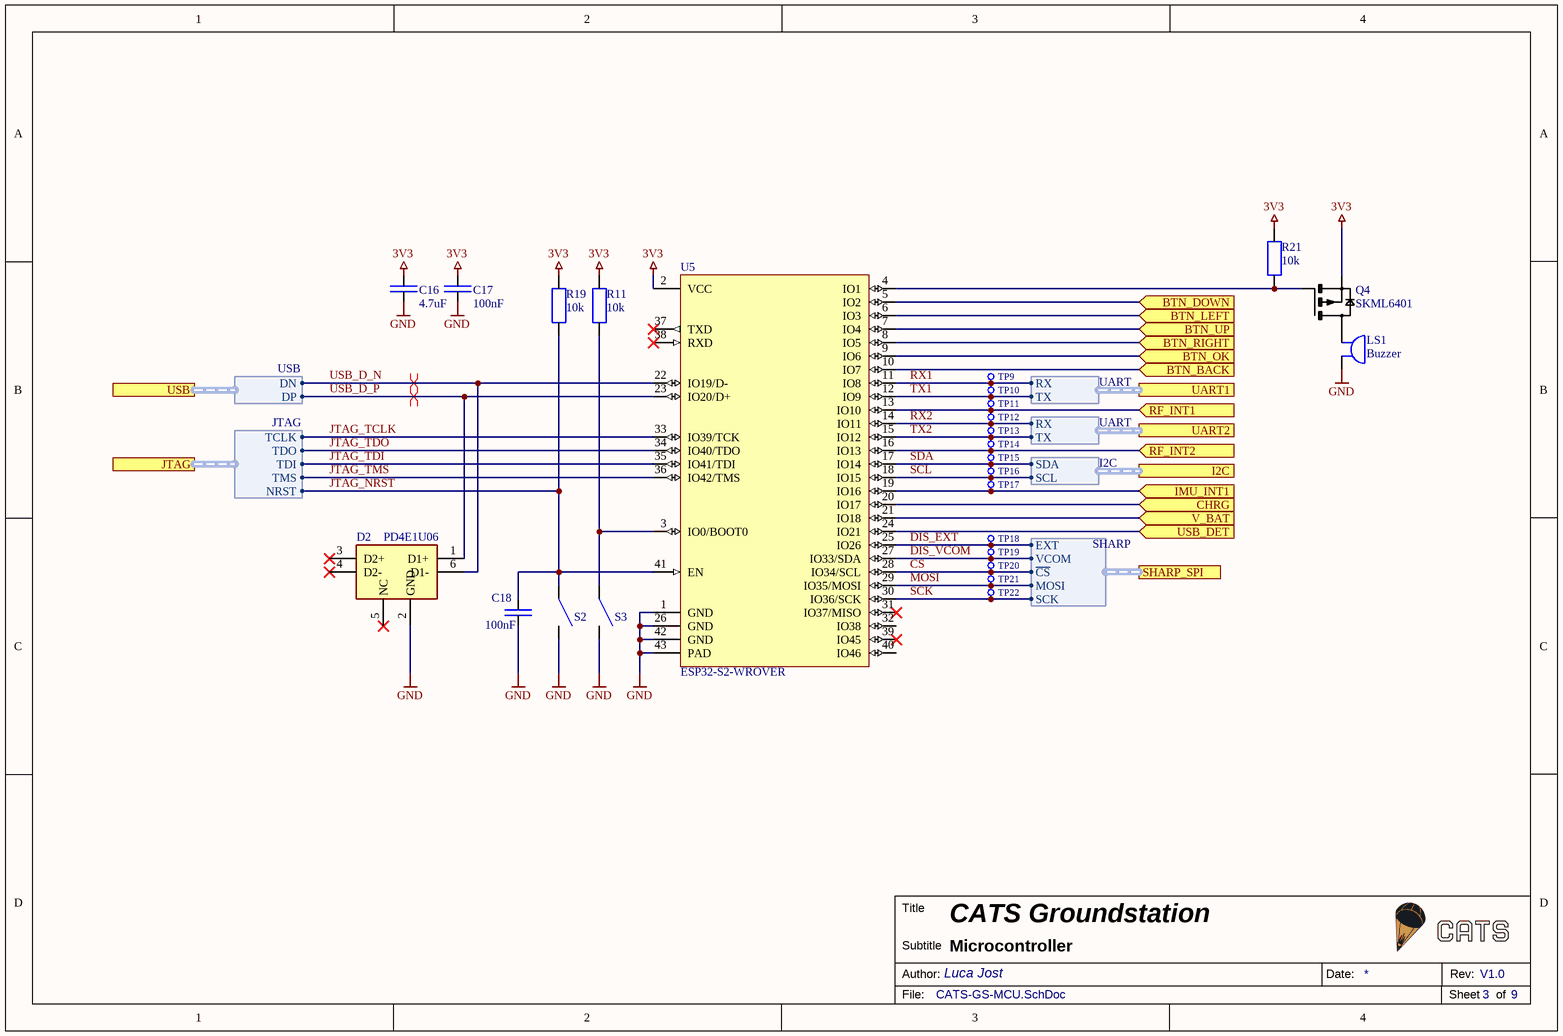
[diagram p8: CATS-GS-MCU.SchDoc]

### Parts
C16  4.7uF  [SMD Keramikkondensator 0402]
C17  100nF  [SMD Keramikkondensator 0402]
C18  100nF  [SMD Keramikkondensator 0402]
D2  PD4E1U06  [SMD IC SOT-363 (SC-70-6)]
LS1  Buzzer  [SMD BUZZER CMT-8504]
Q4  SKML6401  [SMD MOSFET SOT-23]
R11  10k  [SMD Widerstand 0402]
R19  10k  [SMD Widerstand 0402]
R21  10k  [SMD Widerstand 0402]
S2  SMD-Button  [SMD Button 2.5x3x1.2]  (value not drawn)
S3  SMD-Button  [SMD Button 2.5x3x1.2]  (value not drawn)
TP9  X-TP  [SMD Testpoint 1mm]  (value not drawn)  (no BOM)
TP10  X-TP  [SMD Testpoint 1mm]  (value not drawn)  (no BOM)
TP11  X-TP  [SMD Testpoint 1mm]  (value not drawn)  (no BOM)
TP12  X-TP  [SMD Testpoint 1mm]  (value not drawn)  (no BOM)
TP13  X-TP  [SMD Testpoint 1mm]  (value not drawn)  (no BOM)
TP14  X-TP  [SMD Testpoint 1mm]  (value not drawn)  (no BOM)
TP15  X-TP  [SMD Testpoint 1mm]  (value not drawn)  (no BOM)
TP16  X-TP  [SMD Testpoint 1mm]  (value not drawn)  (no BOM)
TP17  X-TP  [SMD Testpoint 1mm]  (value not drawn)  (no BOM)
TP18  X-TP  [SMD Testpoint 1mm]  (value not drawn)  (no BOM)
TP19  X-TP  [SMD Testpoint 1mm]  (value not drawn)  (no BOM)
TP20  X-TP  [SMD Testpoint 1mm]  (value not drawn)  (no BOM)
TP21  X-TP  [SMD Testpoint 1mm]  (value not drawn)  (no BOM)
TP22  X-TP  [SMD Testpoint 1mm]  (value not drawn)  (no BOM)
U5  ESP32-S2-WROVER  [SMD ESP32-S2-WROOM]

### Ports
BTN_BACK (in), BTN_DOWN (in), BTN_LEFT (in), BTN_OK (in), BTN_RIGHT (in), BTN_UP (in), CHRG (in), I2C (harness I2C), IMU_INT1 (in), JTAG (harness JTAG), RF_INT1 (in), RF_INT2 (in), SHARP_SPI (harness SHARP), UART1 (harness UART), UART2 (harness UART), USB (harness USB), USB_DET (in), V_BAT (in)

### Harnesses
SHARP: MOSI, ~{CS}, SCK, VCOM, EXT
USB: DP, DN
JTAG: TMS, TDI, TDO, TCLK, NRST
UART: RX, TX
I2C: SDA, SCL

### Nets
3V3: C16.2 C17.2 Q4.S R11.2 R19.2 R21.2 U5.2(VCC)
GND: C16.1 C17.1 C18.1 D2.2(GND) LS1.2 S2.2 S3.2 U5.1(GND) U5.26(GND) U5.42(GND) U5.43(PAD)
~{CS}: TP20.1 U5.28(IO34/SCL) ; port SHARP_SPI.~{CS}
DIS_EXT: TP18.1 U5.25(IO26) ; port SHARP_SPI.EXT
DIS_VCOM: TP19.1 U5.27(IO33/SDA) ; port SHARP_SPI.VCOM
JTAG_NRST: C18.2 R19.1 S2.1 U5.41(EN) ; port JTAG.NRST
JTAG_TCLK: U5.33(IO39/TCK) ; port JTAG.TCLK
JTAG_TDI: U5.35(IO41/TDI) ; port JTAG.TDI
JTAG_TDO: U5.34(IO40/TDO) ; port JTAG.TDO
JTAG_TMS: U5.36(IO42/TMS) ; port JTAG.TMS
MOSI: TP21.1 U5.29(IO35/MOSI) ; port SHARP_SPI.MOSI
RF_INT1: TP11.1 U5.13(IO10) ; port RF_INT1
RF_INT1: TP14.1 U5.16(IO13) ; port RF_INT2  [a separate net that carries the same name]
RX1: TP9.1 U5.11(IO8) ; port UART1.RX
RX2: TP12.1 U5.14(IO11) ; port UART2.RX
SCK: TP22.1 U5.30(IO36/SCK) ; port SHARP_SPI.SCK
SCL: TP16.1 U5.18(IO15) ; port I2C.SCL
SDA: TP15.1 U5.17(IO14) ; port I2C.SDA
TX1: TP10.1 U5.12(IO9) ; port UART1.TX  [project net RX2]
TX2: TP13.1 U5.15(IO12) ; port UART2.TX  [project net RX2]
USB_D_N: D2.6(D1-) U5.22(IO19/D-) ; port USB.DN
USB_D_P: D2.1(D1+) U5.23(IO20/D+) ; port USB.DP
NetC5_2: U5.21(IO18) ; port V_BAT
NetLS1_1: LS1.1 Q4.D
NetP1_K: U5.20(IO17) ; port CHRG
NetQ4_G: Q4.G R21.1 U5.4(IO1)
NetR1_2: U5.24(IO21) ; port USB_DET
NetR11_1: R11.1 S3.1 U5.3(IO0/BOOT0)
NetS4_1: U5.6(IO3) ; port BTN_LEFT
NetS5_1: U5.5(IO2) ; port BTN_DOWN
NetS6_1: U5.7(IO4) ; port BTN_UP
NetS7_1: U5.8(IO5) ; port BTN_RIGHT
NetS8_1: U5.10(IO7) ; port BTN_BACK
NetS9_1: U5.9(IO6) ; port BTN_OK
NetTP17_1: TP17.1 U5.19(IO16) ; port IMU_INT1

Not connected (* = marked no-connect by the designer): D2 3(D2+)* 4(D2-)* 5(NC)*; U5 31(IO37/MISO)* 32(IO38) 37(TXD)* 38(RXD)* 39(IO45)* 40(IO46)

### Layout directives
differential pair: USB_D_N, USB_D_P

### Notes on the sheet
- Title
- Author:
- Subtitle
- Date:
- Rev:
- File:
- Sheet
- of

### Library data of the parts
C16 = E6 - 4.7uF: SMD Ceramic Capacitor E6; Unit Price: 0.01; Number: -; Supplier: -; JLC: C23733
C17 C18 = E6 - 100nF: SMD Ceramic Capacitor E6; Unit Price: 0.01; Number: -; Supplier: -; JLC: C307331
D2 = PD4E1U06DCKR: Unidirectional 3A (8/20us) 15V (Typ) 6.5V 5.5V (Max) SOT-363 ESD Protection Devices ROHS; Component Description: ESD Suppressor; ComponentLink1Description: Datasheet; ComponentLink1URL: https://datasheet.lcsc.com/lcsc/1810172210_Texas-Instruments-TPD4E1U06DCKR_C194628.pdf; Component Value: PD4E1U06; Digikey: 296-39347-1-ND; Farnell: 3116516; Mouser: 595-TPD4E1U06DCKR; Unit Price: 0.12; JLC: C194628
LS1 = Buzzer: Buzzers Indicator, Internally Driven Piezo 12V 10mA 3kHz 100dB @ 12V, 10cm Through Hole PC Pins; Digikey: 2603-CT08E-06S300-2TR-ND; ComponentLink1Description: Datasheet; ComponentLink1URL: https://datasheet.lcsc.com/lcsc/2001061407_INGHAi-GSC8530RA-16R2700_C255315.pdf; JLC: C255315; Unit Price: 0.4057
Q4 = SKML6401: P Channel MOSFET, 16V 3A, SOT-23; JLC: C475708; ComponentLink1Description: Datasheet; ComponentLink1URL: https://datasheet.lcsc.com/lcsc/2001131004_Shikues-SKML6401_C475708.pdf
R11 R19 R21 = E24 - 10k: SMD Chip Resistor E24; Unit Price: 0.01; Number: -; Supplier: -; JLC: C25744
S2 S3 = Button 3mmx2.5mm: Button SPST; Digikey: SW1020TR-ND; JLC: C128937
TP9-TP22 = X-TP: as TP1 on sheet CATS-GS-PM; Unit Price: 0.00
U5 = ESP32-S2-WROVER: WiFi 802.11b/g/n Transceiver Module 2.4GHz Antenna, Surface Mount; ComponentLink1Description: Datasheet; ComponentLink1URL: https://www.espressif.com/sites/default/files/documentation/esp32-s2-wroom_esp32-s2-wroom-i_datasheet_en.pdf; JLC: C701333; Digikey: 1965-ESP32-S2-WROOMTR-ND

## Nets that join several sheets
3V3: CATS-GS-Overview (X6.1), CATS-GS-Sensors (12 pins), U_CATS_GS-Telemetry/U_Reefing-Radio (C32_U_CATS_GS-Telemetry_U_Reefing-Radio#1.2 U10_U_CATS_GS-Telemetry_U_Reefing-Radio#1.11), U_CATS_GS-Telemetry/U_Reefing-Radio_MCU (6 pins), U_CATS_GS-Telemetry/U_Reefing-Radio (C32_U_CATS_GS-Telemetry_U_Reefing-Radio#2.2 U10_U_CATS_GS-Telemetry_U_Reefing-Radio#2.11), U_CATS_GS-Telemetry/U_Reefing-Radio_MCU (6 pins), CATS-GS-GNSS (C26.2 C27.2 U8.6 U8.8), CATS-GS-PM (7 pins), CATS-GS-MCU (7 pins)
3V3A_RADIO: U_CATS_GS-Telemetry/U_Reefing-Radio (C36_U_CATS_GS-Telemetry_U_Reefing-Radio#1.2 C37_U_CATS_GS-Telemetry_U_Reefing-Radio#1.2 U10_U_CATS_GS-Telemetry_U_Reefing-Radio#1.15), U_CATS_GS-Telemetry/U_Reefing-Radio (C36_U_CATS_GS-Telemetry_U_Reefing-Radio#2.2 C37_U_CATS_GS-Telemetry_U_Reefing-Radio#2.2 U10_U_CATS_GS-Telemetry_U_Reefing-Radio#2.15), CATS-GS-PM (C10.2 L2.2 TP7.1)
5V: CATS-GS-Overview (C25.2 X5.5 X5.6 X5.7), CATS-GS-PM (C14.2 C15.2 TP8.1 U4.3)
BGND: CATS-GS-Overview (X3.2), CATS-GS-PM (C1.1 U1.3)
GND: CATS-GS-Overview (14 pins), CATS-GS-Sensors (12 pins), U_CATS_GS-Telemetry/U_Reefing-Radio (16 pins), U_CATS_GS-Telemetry/U_Reefing-Radio_MCU (6 pins), U_CATS_GS-Telemetry/U_Reefing-Radio (16 pins), U_CATS_GS-Telemetry/U_Reefing-Radio_MCU (6 pins), CATS-GS-GNSS (12 pins), CATS-GS-PM (22 pins), CATS-GS-USB (9 pins), CATS-GS-MCU (11 pins)
VBAT: CATS-GS-Overview (X3.1), CATS-GS-PM (R6.2 S1.3 U3.3)
VBUS: CATS-GS-PM (8 pins), CATS-GS-USB (R1.1 X1.A4B9 X1.B4A9)
BUSY: U_CATS_GS-Telemetry/U_Reefing-Radio (U10_U_CATS_GS-Telemetry_U_Reefing-Radio#1.7), U_CATS_GS-Telemetry/U_Reefing-Radio_MCU (U9_U_CATS_GS-Telemetry_U_Reefing-Radio_MCU#1.15)
BUSY: U_CATS_GS-Telemetry/U_Reefing-Radio (U10_U_CATS_GS-Telemetry_U_Reefing-Radio#2.7), U_CATS_GS-Telemetry/U_Reefing-Radio_MCU (U9_U_CATS_GS-Telemetry_U_Reefing-Radio_MCU#2.15)
~{CS}: CATS-GS-Overview (X5.3), CATS-GS-MCU (TP20.1 U5.28)
CS: U_CATS_GS-Telemetry/U_Reefing-Radio (U10_U_CATS_GS-Telemetry_U_Reefing-Radio#1.19), U_CATS_GS-Telemetry/U_Reefing-Radio_MCU (U9_U_CATS_GS-Telemetry_U_Reefing-Radio_MCU#1.14)
CS: U_CATS_GS-Telemetry/U_Reefing-Radio (U10_U_CATS_GS-Telemetry_U_Reefing-Radio#2.19), U_CATS_GS-Telemetry/U_Reefing-Radio_MCU (U9_U_CATS_GS-Telemetry_U_Reefing-Radio_MCU#2.14)
DIO1: U_CATS_GS-Telemetry/U_Reefing-Radio (U10_U_CATS_GS-Telemetry_U_Reefing-Radio#1.8), U_CATS_GS-Telemetry/U_Reefing-Radio_MCU (U9_U_CATS_GS-Telemetry_U_Reefing-Radio_MCU#1.11)
DIO1: U_CATS_GS-Telemetry/U_Reefing-Radio (U10_U_CATS_GS-Telemetry_U_Reefing-Radio#2.8), U_CATS_GS-Telemetry/U_Reefing-Radio_MCU (U9_U_CATS_GS-Telemetry_U_Reefing-Radio_MCU#2.11)
DIO2: U_CATS_GS-Telemetry/U_Reefing-Radio (U10_U_CATS_GS-Telemetry_U_Reefing-Radio#1.9), U_CATS_GS-Telemetry/U_Reefing-Radio_MCU (U9_U_CATS_GS-Telemetry_U_Reefing-Radio_MCU#1.10)
DIO2: U_CATS_GS-Telemetry/U_Reefing-Radio (U10_U_CATS_GS-Telemetry_U_Reefing-Radio#2.9), U_CATS_GS-Telemetry/U_Reefing-Radio_MCU (U9_U_CATS_GS-Telemetry_U_Reefing-Radio_MCU#2.10)
DIS_EXT: CATS-GS-Overview (X5.8), CATS-GS-MCU (TP18.1 U5.25)
DIS_VCOM: CATS-GS-Overview (X5.4), CATS-GS-MCU (TP19.1 U5.27)
JTAG_NRST: CATS-GS-Overview (X6.10), CATS-GS-MCU (C18.2 R19.1 S2.1 U5.41)
JTAG_TCLK: CATS-GS-Overview (X6.4), CATS-GS-MCU (U5.33)
JTAG_TDI: CATS-GS-Overview (X6.8), CATS-GS-MCU (U5.35)
JTAG_TDO: CATS-GS-Overview (X6.6), CATS-GS-MCU (U5.34)
JTAG_TMS: CATS-GS-Overview (X6.2), CATS-GS-MCU (U5.36)
MISO1: U_CATS_GS-Telemetry/U_Reefing-Radio (U10_U_CATS_GS-Telemetry_U_Reefing-Radio#1.16), U_CATS_GS-Telemetry/U_Reefing-Radio_MCU (U9_U_CATS_GS-Telemetry_U_Reefing-Radio_MCU#1.12)
MISO1: U_CATS_GS-Telemetry/U_Reefing-Radio (U10_U_CATS_GS-Telemetry_U_Reefing-Radio#2.16), U_CATS_GS-Telemetry/U_Reefing-Radio_MCU (U9_U_CATS_GS-Telemetry_U_Reefing-Radio_MCU#2.12)
MOSI: CATS-GS-Overview (X5.2), CATS-GS-MCU (TP21.1 U5.29)
MOSI1: U_CATS_GS-Telemetry/U_Reefing-Radio (U10_U_CATS_GS-Telemetry_U_Reefing-Radio#1.17), U_CATS_GS-Telemetry/U_Reefing-Radio_MCU (U9_U_CATS_GS-Telemetry_U_Reefing-Radio_MCU#1.13)
MOSI1: U_CATS_GS-Telemetry/U_Reefing-Radio (U10_U_CATS_GS-Telemetry_U_Reefing-Radio#2.17), U_CATS_GS-Telemetry/U_Reefing-Radio_MCU (U9_U_CATS_GS-Telemetry_U_Reefing-Radio_MCU#2.13)
NetC5_2: CATS-GS-PM (C5.2 R5.1 R7.2 TP3.1), CATS-GS-MCU (U5.21)
NetFL1_U_CATS_GS-Telemetry_U_Reefing-Radio#1_3: CATS-GS-Overview (X2.1), U_CATS_GS-Telemetry/U_Reefing-Radio (FL1_U_CATS_GS-Telemetry_U_Reefing-Radio#1.3)
NetFL1_U_CATS_GS-Telemetry_U_Reefing-Radio#2_3: CATS-GS-Overview (X4.1), U_CATS_GS-Telemetry/U_Reefing-Radio (FL1_U_CATS_GS-Telemetry_U_Reefing-Radio#2.3)
NetP1_K: CATS-GS-PM (P1.K U3.1), CATS-GS-MCU (U5.20)
NetR1_2: CATS-GS-USB (R1.2 R4.1), CATS-GS-MCU (U5.24)
NetS4_1: CATS-GS-Overview (S4.1), CATS-GS-MCU (U5.6)
NetS5_1: CATS-GS-Overview (S5.1), CATS-GS-MCU (U5.5)
NetS6_1: CATS-GS-Overview (S6.1), CATS-GS-MCU (U5.7)
NetS7_1: CATS-GS-Overview (S7.1), CATS-GS-MCU (U5.8)
NetS8_1: CATS-GS-Overview (S8.1), CATS-GS-MCU (U5.10)
NetS9_1: CATS-GS-Overview (S9.1), CATS-GS-MCU (U5.9)
NetTP17_1: CATS-GS-Sensors (U7.4), CATS-GS-MCU (TP17.1 U5.19)
NetU9_U_CATS_GS-Telemetry_U_Reefing-Radio_MCU#1_19: U_CATS_GS-Telemetry/U_Reefing-Radio (U10_U_CATS_GS-Telemetry_U_Reefing-Radio#1.3), U_CATS_GS-Telemetry/U_Reefing-Radio_MCU (U9_U_CATS_GS-Telemetry_U_Reefing-Radio_MCU#1.19)
NetU9_U_CATS_GS-Telemetry_U_Reefing-Radio_MCU#2_19: U_CATS_GS-Telemetry/U_Reefing-Radio (U10_U_CATS_GS-Telemetry_U_Reefing-Radio#2.3), U_CATS_GS-Telemetry/U_Reefing-Radio_MCU (U9_U_CATS_GS-Telemetry_U_Reefing-Radio_MCU#2.19)
RF_INT1: U_CATS_GS-Telemetry/U_Reefing-Radio_MCU (U9_U_CATS_GS-Telemetry_U_Reefing-Radio_MCU#1.28), CATS-GS-MCU (TP11.1 U5.13)
RF_INT1: U_CATS_GS-Telemetry/U_Reefing-Radio_MCU (U9_U_CATS_GS-Telemetry_U_Reefing-Radio_MCU#2.28), CATS-GS-MCU (TP14.1 U5.16)
RX1: U_CATS_GS-Telemetry/U_Reefing-Radio_MCU (U9_U_CATS_GS-Telemetry_U_Reefing-Radio_MCU#1.8), CATS-GS-MCU (TP9.1 U5.11)
RX1: U_CATS_GS-Telemetry/U_Reefing-Radio_MCU (U9_U_CATS_GS-Telemetry_U_Reefing-Radio_MCU#2.27), CATS-GS-GNSS (U8.2)
RX2: U_CATS_GS-Telemetry/U_Reefing-Radio_MCU (U9_U_CATS_GS-Telemetry_U_Reefing-Radio_MCU#1.9), CATS-GS-MCU (TP10.1 U5.12)
RX2: U_CATS_GS-Telemetry/U_Reefing-Radio_MCU (U9_U_CATS_GS-Telemetry_U_Reefing-Radio_MCU#2.8), CATS-GS-MCU (TP12.1 U5.14)
RX2: U_CATS_GS-Telemetry/U_Reefing-Radio_MCU (U9_U_CATS_GS-Telemetry_U_Reefing-Radio_MCU#2.9), CATS-GS-MCU (TP13.1 U5.15)
SCK: CATS-GS-Overview (X5.1), CATS-GS-MCU (TP22.1 U5.30)
SCK1: U_CATS_GS-Telemetry/U_Reefing-Radio (U10_U_CATS_GS-Telemetry_U_Reefing-Radio#1.18), U_CATS_GS-Telemetry/U_Reefing-Radio_MCU (U9_U_CATS_GS-Telemetry_U_Reefing-Radio_MCU#1.7)
SCK1: U_CATS_GS-Telemetry/U_Reefing-Radio (U10_U_CATS_GS-Telemetry_U_Reefing-Radio#2.18), U_CATS_GS-Telemetry/U_Reefing-Radio_MCU (U9_U_CATS_GS-Telemetry_U_Reefing-Radio_MCU#2.7)
SCL: CATS-GS-Sensors (R14.1 U6.1 U7.13), CATS-GS-MCU (TP16.1 U5.18)
SDA: CATS-GS-Sensors (R13.1 U6.16 U7.14), CATS-GS-MCU (TP15.1 U5.17)
TX1: U_CATS_GS-Telemetry/U_Reefing-Radio_MCU (U9_U_CATS_GS-Telemetry_U_Reefing-Radio_MCU#2.26), CATS-GS-GNSS (U8.3)
USB_D_N: CATS-GS-USB (X1.A7 X1.B7), CATS-GS-MCU (D2.6 U5.22)
USB_D_P: CATS-GS-USB (X1.A6 X1.B6), CATS-GS-MCU (D2.1 U5.23)